# EAGLE design power_board (EAGLE 9.3.2)
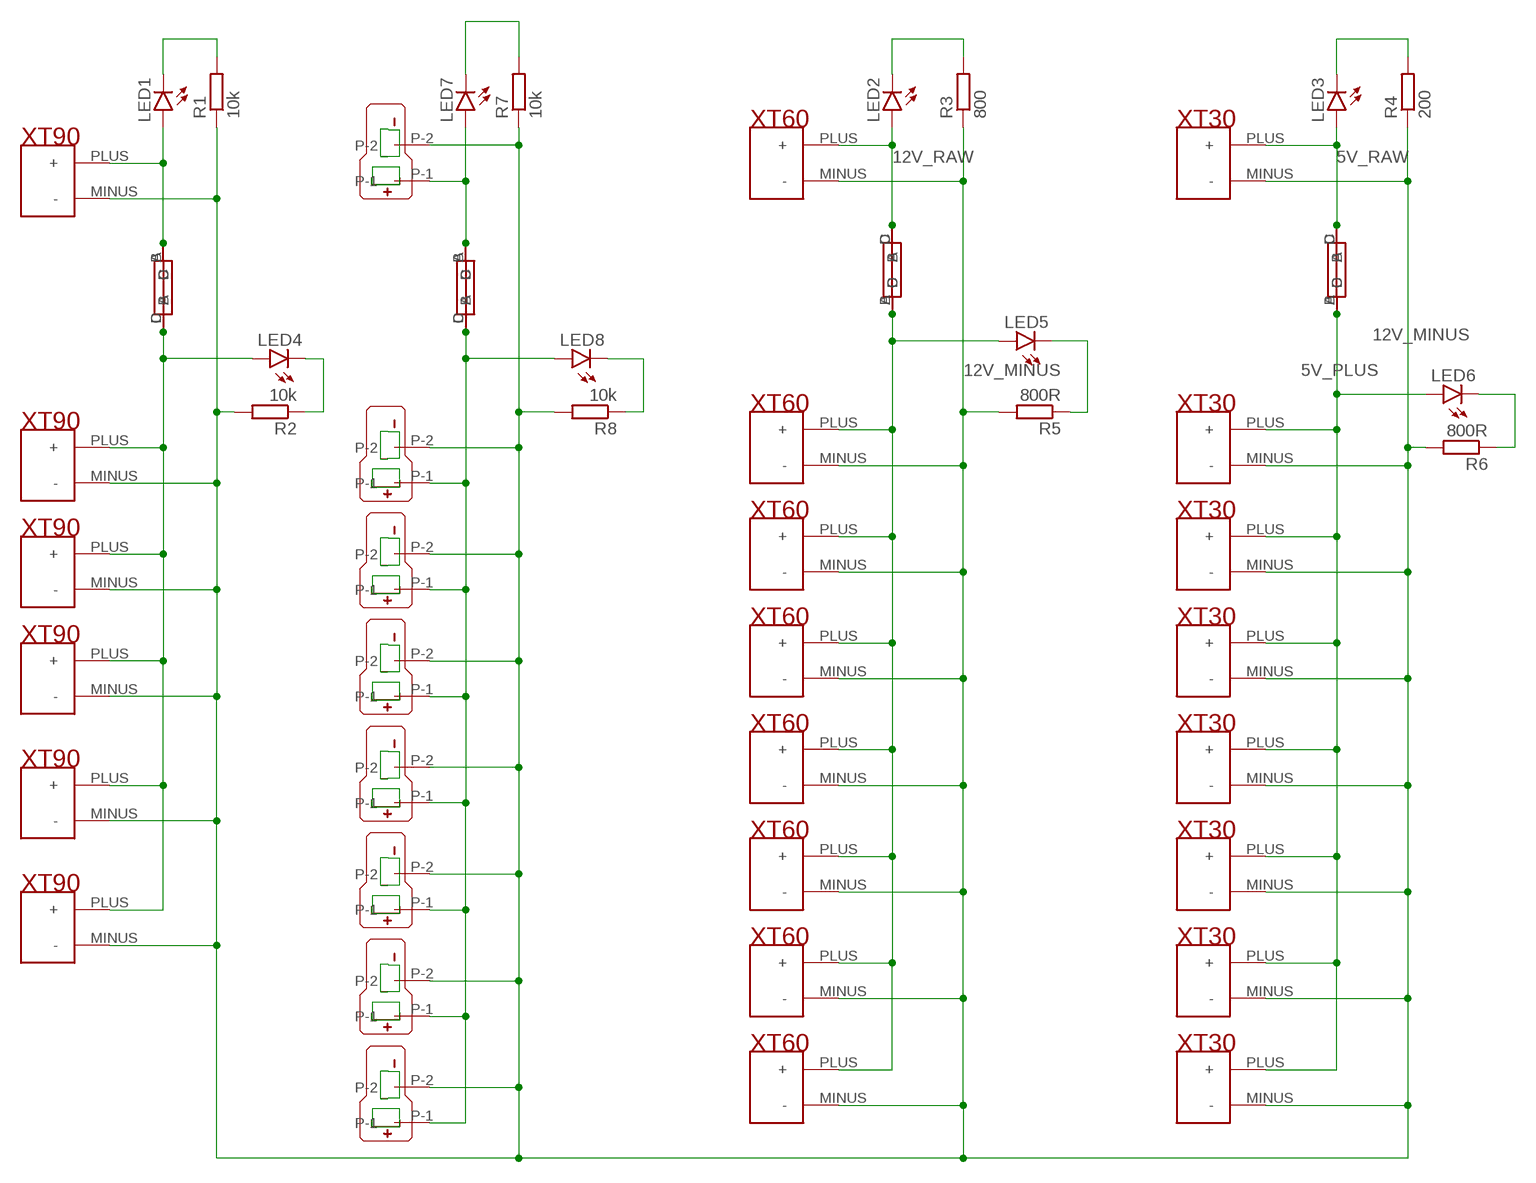
[diagram p0: schematic, sheet 1]

## Parts
LED1  LED5MM  [LED5MM]
LED2  LED5MM  [LED5MM]
LED3  LED5MM  [LED5MM]
LED4  LED5MM  [LED5MM]
LED5  LED5MM  [LED5MM]
LED6  LED5MM  [LED5MM]
LED7  LED5MM  [LED5MM]
LED8  LED5MM  [LED5MM]
R1  10k  R-EU_M1206  [M1206]
R2  10k  R-EU_M1206  [M1206]
R3  800  R-EU_M1206  [M1206]
R4  200  R-EU_M1206  [M1206]
R5  800R  R-EU_M1206  [M1206]
R6  800R  R-EU_M1206  [M1206]
R7  10k  R-EU_M1206  [M1206]
R8  10k  R-EU_M1206  [M1206]
U$1  XT90  [XT90_FOOTPRINT]
U$2  XT90  [XT90_FOOTPRINT]
U$3  XT90  [XT90_FOOTPRINT]
U$4  XT90  [XT90_FOOTPRINT]
U$5  XT60  [XT60_FOOTPRINT]
U$6  XT60  [XT60_FOOTPRINT]
U$7  XT60  [XT60_FOOTPRINT]
U$8  XT60  [XT60_FOOTPRINT]
U$9  XT60  [XT60_FOOTPRINT]
U$10  XT60  [XT60_FOOTPRINT]
U$11  XT60  [XT60_FOOTPRINT]
U$12  XT60  [XT60_FOOTPRINT]
U$13  XT30  [XT30_FOOTPRINT]
U$14  XT30  [XT30_FOOTPRINT]
U$15  XT30  [XT30_FOOTPRINT]
U$16  XT30  [XT30_FOOTPRINT]
U$17  XT30  [XT30_FOOTPRINT]
U$18  XT30  [XT30_FOOTPRINT]
U$19  XT30  [XT30_FOOTPRINT]
U$20  XT30  [XT30_FOOTPRINT]
U$21  AUTOFUSE  [AUTOFUSE_HOLDER]
U$22  AUTOFUSE  [AUTOFUSE_HOLDER]
U$23  AUTOFUSE  [AUTOFUSE_HOLDER]
U$24  XT90  [XT90_FOOTPRINT]
U$25  T-PLUG_CONNECTOR  [T_PLUG_CONNECTOR]
U$26  T-PLUG_CONNECTOR  [T_PLUG_CONNECTOR]
U$27  T-PLUG_CONNECTOR  [T_PLUG_CONNECTOR]
U$28  T-PLUG_CONNECTOR  [T_PLUG_CONNECTOR]
U$29  T-PLUG_CONNECTOR  [T_PLUG_CONNECTOR]
U$30  AUTOFUSE  [AUTOFUSE_HOLDER]
U$31  T-PLUG_CONNECTOR  [T_PLUG_CONNECTOR]
U$32  T-PLUG_CONNECTOR  [T_PLUG_CONNECTOR]
U$33  T-PLUG_CONNECTOR  [T_PLUG_CONNECTOR]
U$34  XT90  [XT90_FOOTPRINT]

## Nets
5V_PLUS: LED6.A U$14.PLUS(+) U$15.PLUS(+) U$16.PLUS(+) U$17.PLUS(+) U$18.PLUS(+) U$19.PLUS(+) U$20.PLUS(+) U$23.A U$23.B
5V_RAW: LED3.A U$13.PLUS(+) U$23.C U$23.D
12V_MINUS: R1.1 R2.2 R3.1 R4.1 R5.2 R6.2 R7.1 R8.2 U$1.MINUS(-) U$2.MINUS(-) U$3.MINUS(-) U$4.MINUS(-) U$5.MINUS(-) U$6.MINUS(-) U$7.MINUS(-) U$8.MINUS(-) U$9.MINUS(-) U$10.MINUS(-) U$11.MINUS(-) U$12.MINUS(-) U$13.MINUS(-) U$14.MINUS(-) U$15.MINUS(-) U$16.MINUS(-) U$17.MINUS(-) U$18.MINUS(-) U$19.MINUS(-) U$20.MINUS(-) U$24.MINUS(-) U$25.P-2 U$26.P-2 U$27.P-2 U$28.P-2 U$29.P-2 U$31.P-2 U$32.P-2 U$33.P-2 U$34.MINUS(-)
12V_PLUS: LED5.A U$6.PLUS(+) U$7.PLUS(+) U$8.PLUS(+) U$9.PLUS(+) U$10.PLUS(+) U$11.PLUS(+) U$12.PLUS(+) U$22.A U$22.B
12V_RAW: LED2.A U$5.PLUS(+) U$22.C U$22.D
BATT_PLUS: LED4.A U$2.PLUS(+) U$3.PLUS(+) U$4.PLUS(+) U$21.C U$21.D U$24.PLUS(+) U$34.PLUS(+)
BATT_RAW: LED1.A U$1.PLUS(+) U$21.A U$21.B
N$1: LED1.K(C) R1.2
N$2: LED5.K(C) R5.1
N$3: LED3.K(C) R4.2
N$4: LED6.K(C) R6.1
N$5: LED4.K(C) R2.1
N$8: LED2.K(C) R3.2
N$9: LED7.A U$25.P-1 U$30.A U$30.B
N$10: LED7.K(C) R7.2
N$12: LED8.A U$26.P-1 U$27.P-1 U$28.P-1 U$29.P-1 U$30.C U$30.D U$31.P-1 U$32.P-1 U$33.P-1
N$13: LED8.K(C) R8.1

## Library data of the parts
LED1-LED8 = led:LED: LED OSRAM: - CHIPLED LG R971, LG N971, LY N971, LG Q971, LY Q971, LO R971, LY R971 LH N974, LH R974 LS Q976, LO Q976, LY Q976 LO Q996 - Hyper CHIPLED LW Q18S LB Q993, LB Q99A, LB R99A - SideLED LS A670, LO A670, LY A670, LG A670, LP A670 LB A673, LV A673, LT A673, LW A673 LH A674 LY A675 LS A676, LA A676, LO A676, LY A676, LW A676 LS A679, LY A679, LG A679 - Hyper Micro SIDELED® LS Y876, LA Y876, LO Y876, LY Y876 LT Y87S - SmartLED LW L88C, LW L88S LB L89C, LB L89S, LG L890 LS L89K, LO L89K, LY L89K LS L896, LA L896, LO L896, LY L896 - TOPLED LS T670, LO T670, LY T670, LG T670, LP T670 LSG T670, LSP T670, LSY T670, LOP T670, LYG T670 LG T671, LOG T671, LSG T671 LB T673, LV T673, LT T673, LW T673 LH T674 LS T676, LA T676, LO T676, LY T676, LB T676, LH T676, LSB T676, LW T676 LB T67C, LV T67C, LT T67C, LS T67K, LO T67K, LY T67K, LW E67C LS E67B, LA E67B, LO E67B, LY E67B, LB E67C, LV E67C, LT E67C LW T67C LS T679, LY T679, LG T679 LS T770, LO T770, LY T770, LG T770, LP T770 LB T773, LV T773, LT T773, LW T773 LH T774 LS E675, LA E675, LY E675, LS T675 LS T776, LA T776, LO T776, LY T776, LB T776 LHGB T686 LT T68C, LB T68C - Hyper Mini TOPLED® LB M676 - Mini TOPLED Santana® LG M470 LS M47K, LO M47K, LY M47K Source: http://www.osram.convergy.de LUXEON: - LUMILED® LXK2-PW12-R00, LXK2-PW12-S00, LXK2-PW14-U00, LXK2-PW14-V00 LXK2-PM12-R00, LXK2-PM12-S00, LXK2-PM14-U00 LXK2-PE12-Q00, LXK2-PE12-R00, LXK2-PE12-S00, LXK2-PE14-T00, LXK2-PE14-U00 LXK2-PB12-K00, LXK2-PB12-L00, LXK2-PB12-M00, LXK2-PB14-N00, LXK2-PB14-P00, LXK2-PB14-Q00 LXK2-PR12-L00, LXK2-PR12-M00, LXK2-PR14-Q00, LXK2-PR14-R00 LXK2-PD12-Q00, LXK2-PD12-R00, LXK2-PD12-S00 LXK2-PH12-R00, LXK2-PH12-S00 LXK2-PL12-P00, LXK2-PL12-Q00, LXK2-PL12-R00 Source: www.luxeon.com KINGBRIGHT: KA-3528ASYC Source: www.kingbright.com
R1-R8 = rcl:R-EU_: RESISTOR, European symbol; SPICEPREFIX: R
U$1-U$4 U$24 U$34 = XT_connectors:XT90
U$5-U$12 = XT_connectors:XT60
U$13-U$20 = XT_connectors:XT30
U$21-U$23 U$30 = AutoFuse_Holder:AUTOFUSE
U$25-U$29 U$31-U$33 = con-T-plug:T-PLUG_CONNECTOR

## Board
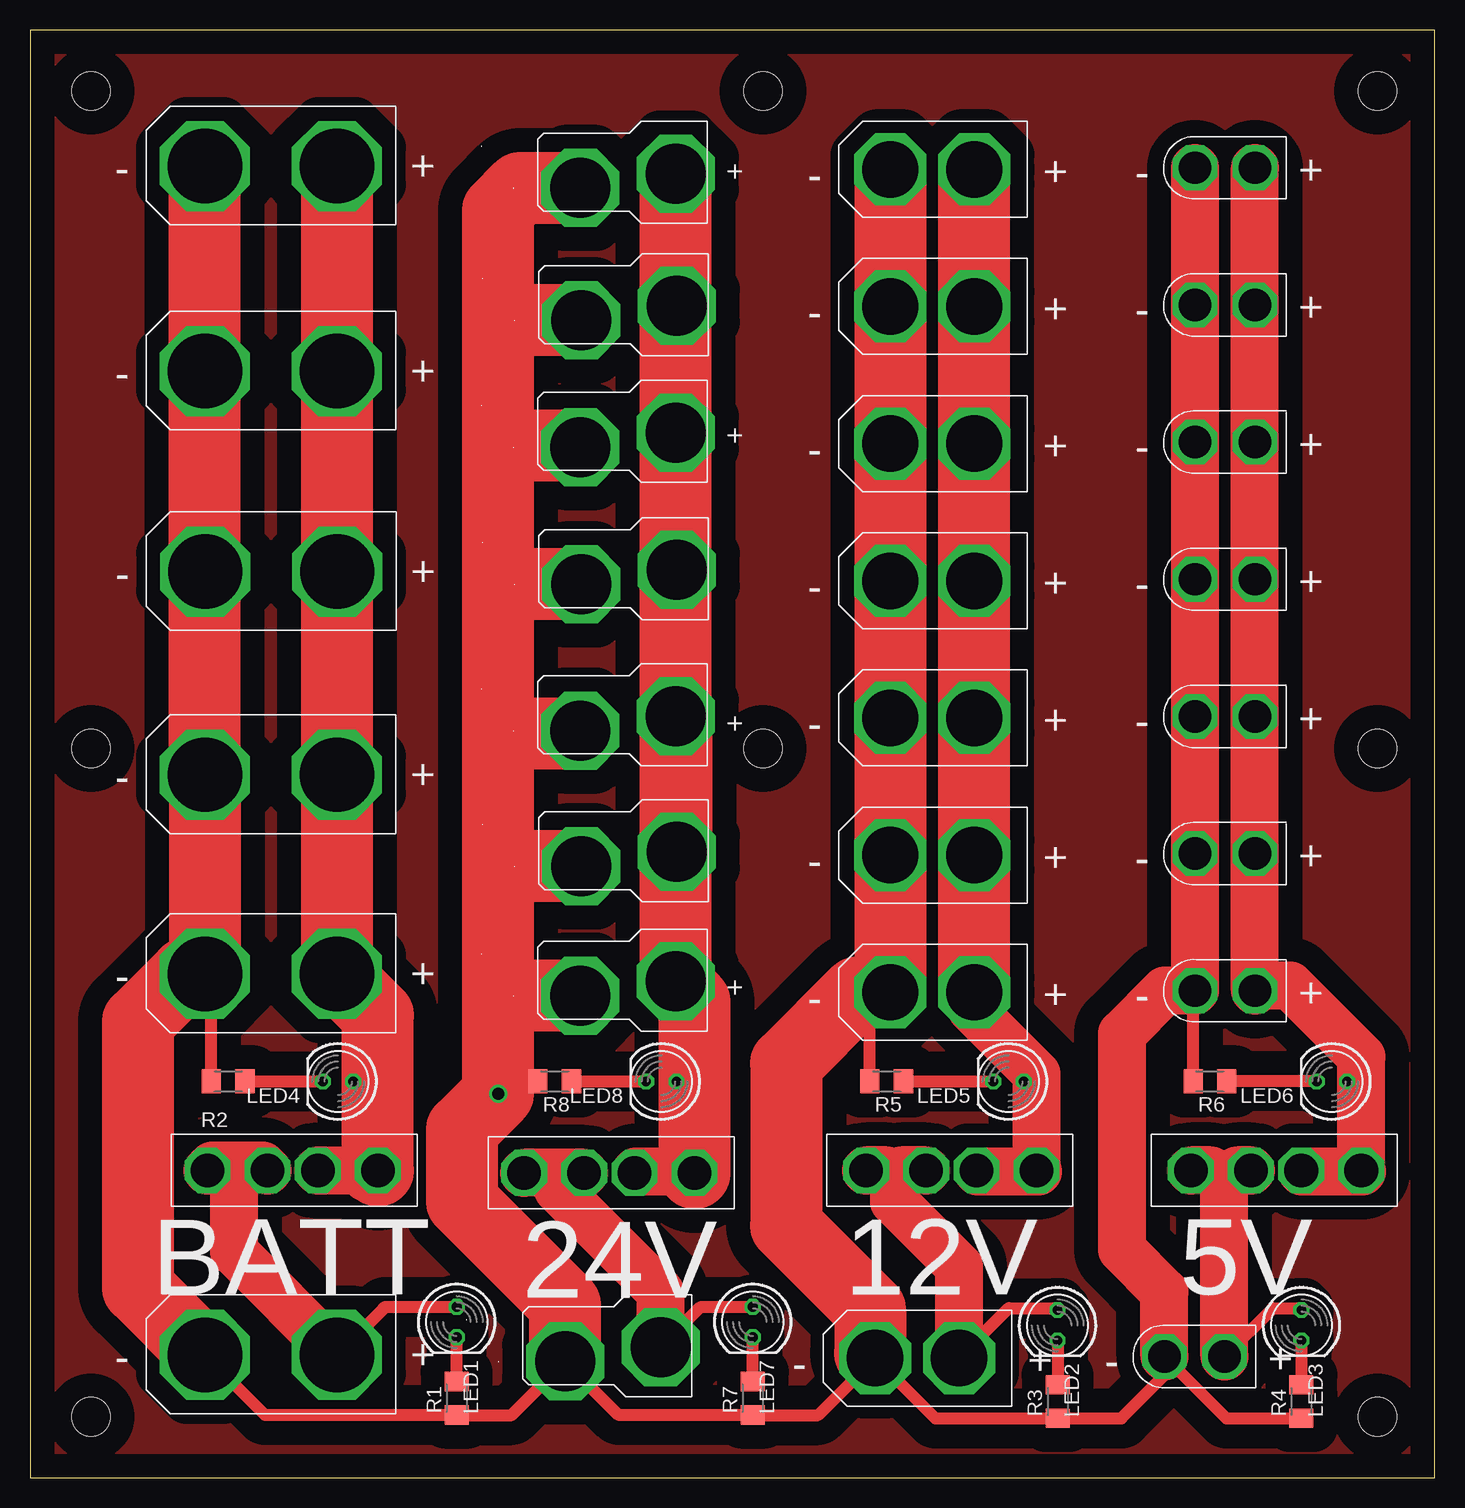
[diagram p1: board, top side]
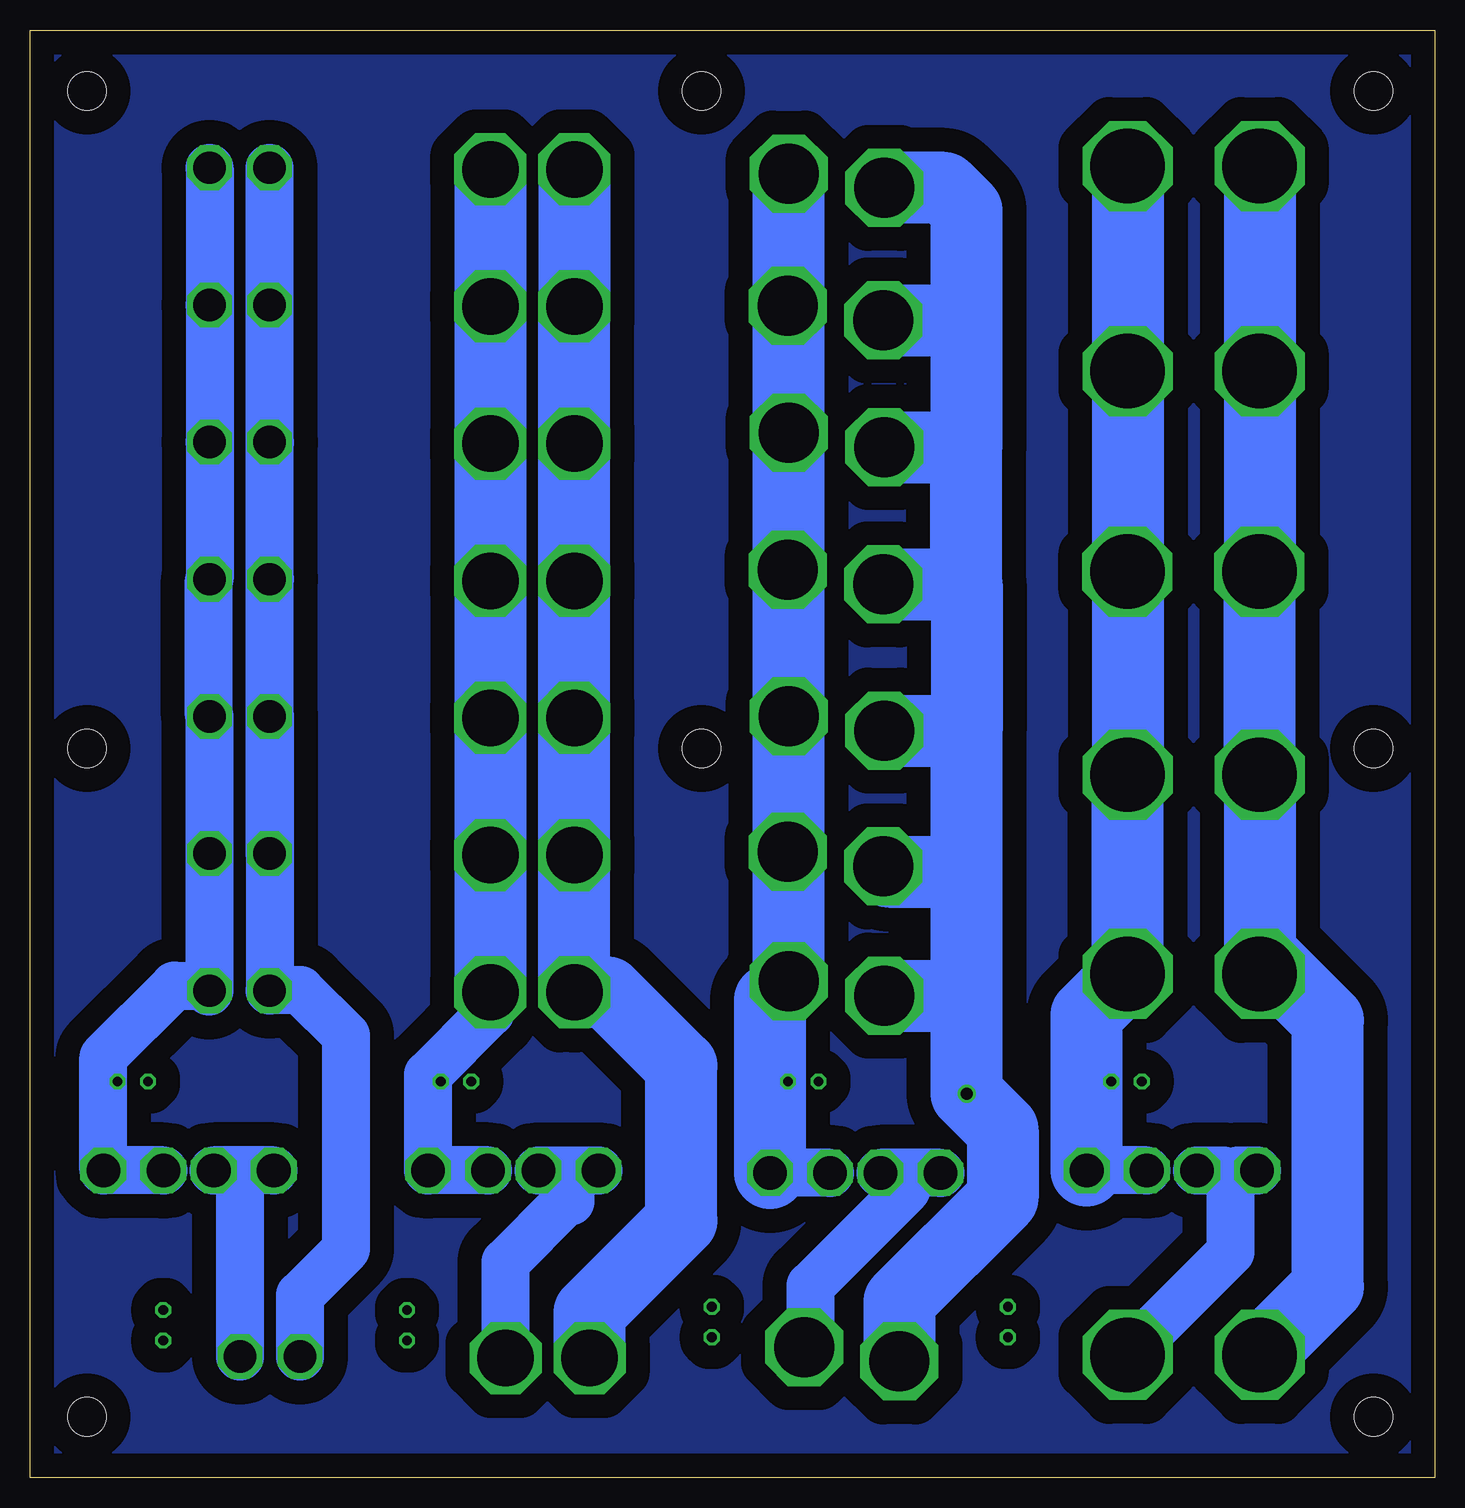
[diagram p2: board, bottom side, seen from below]

Size 117.05 x 120.64 mm. Coordinates in mm from the lower left corner, seen from the top.
Outline: 0,0 117.05,0 117.05,120.64 0,120.64 0,0
Copper layers (1*16): Top 0.035mm / dielectric 1.5mm / Bottom 0.035mm
Design rules "default": minimum track width 6mil, minimum drill 0.35mm, track to track 6mil, track to pad 6mil, pad to pad 6mil, via to via 6mil, smd to smd 6mil, copper to edge 40mil, drill to drill 6mil, minimum pad ring 10mil, minimum via ring 8mil, stop-mask expansion 4mil, vias tented up to drill 0mil, thermal gap 10mil
Holes 3.2 mm at 5.08,115.57 112.3,115.57 5.08,5.08 112.3,5.08 5.08,60.77 112.3,60.77 61.08,60.77 61.08,115.57

### Footprints (pad centres in the part's own frame; a part is rotated, then mirrored left to right if it is on the bottom)
LED5MM = drill 0.813 octagon: A -1.27,0; K 1.27,0
M1206 = smd 1.6 x 2: 1 -1.4,0; 2 1.4,0
XT90_FOOTPRINT = drill 6.2 pad 7.5 octagon: MINUS 15.9,5; PLUS 4.9,5
XT60_FOOTPRINT = drill 4.7 pad 6 octagon: MINUS 11.4,4; PLUS 4.4,4
XT30_FOOTPRINT = drill 2.7 octagon: MINUS 7.6,2.6; PLUS 2.6,2.6
AUTOFUSE_HOLDER = drill 2.8 pad 3.81 octagon: A 0,0; B 5,0; C 9.2,0; D 14.2,0
T_PLUG_CONNECTOR = drill 5 pad 6.5 octagon: P-1 2.6,4.35; P-2 10.55,5.55

### Placement (x,y rotation side)
LED1  35.56,12.97 270 top
LED2  85.63,12.7 270 top
LED3  105.95,12.7 270 top
LED4  25.67,33.02 180 top
LED5  81.55,33.02 180 top
LED6  108.49,33.02 180 top
LED7  60.23,12.97 270 top
LED8  52.61,33.02 180 top
R1  35.56,6.62 90 top
R2  16.51,33.02 180 top
R3  85.63,6.35 90 top
R4  105.95,6.35 90 top
R5  71.39,33.02 180 top
R6  98.33,33.02 180 top
R7  60.23,6.62 90 top
R8  43.72,33.02 180 top
U$1  30.48,15.24 180 top
U$2  30.48,114.3 180 top
U$3  30.48,46.99 180 top
U$4  30.48,97.21 180 top
U$5  81.82,13.97 180 top
U$6  83.09,101.6 180 top
U$7  83.09,78.74 180 top
U$8  83.09,90.17 180 top
U$9  83.09,55.88 180 top
U$10  83.09,67.31 180 top
U$11  83.09,113.03 180 top
U$12  83.09,44.45 180 top
U$13  102.14,12.7 180 top
U$14  104.68,54.61 180 top
U$15  104.68,88.9 180 top
U$16  104.68,100.33 180 top
U$17  104.68,77.47 180 top
U$18  104.68,66.04 180 top
U$19  104.68,111.76 180 top
U$20  104.68,43.18 180 top
U$21  14.79,25.6 0 top
U$22  83.88,25.6 180 top
U$23  110.94,25.6 180 top
U$24  30.48,63.58 180 top
U$25  55.15,15.24 180 top
U$26  56.42,91.44 180 top
U$27  56.42,45.72 180 top
U$28  56.42,67.81 180 top
U$29  56.42,113.03 180 top
U$30  41.18,25.4 0 top
U$31  56.5,102 180 top
U$32  56.5,80 180 top
U$33  56.5,56.5 180 top
U$34  30.5,80.5 180 top

### Tracks (layer width: path | path; a pad name or v marks a point on that pad's centre or on a via)
5V_PLUS
  Top 1: U$20.PLUS 102.14,40.64 103.41,40.64 109.76,34.29 LED6.A
  Top 4: U$20.PLUS U$19.PLUS | U$23.A 110.94,35.06 105,41 102.5,41 102.14,40.64
  Bottom 4: U$19.PLUS U$16.PLUS U$15.PLUS U$17.PLUS 102.14,74.81 102.14,63.5 U$18.PLUS U$14.PLUS U$20.PLUS 102.14,40.52 102.62,41 105,41 110.94,35.06 U$23.A U$23.B
5V_RAW
  Top 1: 103.56,14.12 105.8,14.12 LED3.A
  Top 1.016: U$13.PLUS 103.56,14.12
  Top 4: U$13.PLUS 99.54,24.46 98.4,25.6 U$23.D | U$23.C 100.6,25.6
  Bottom 4: U$23.D 99,25.6 | 99,25.6 U$23.C | U$13.PLUS 99.54,25.06 99,25.6
12V_MINUS  (via drill 1)
  Top 1: R5.2 69.99,38.75 U$12.MINUS | R6.2 96.93,40.43 U$20.MINUS | R2.2 15.11,41.46 U$3.MINUS | R8.2 40.02,33.02 v39,32 | R3.1 90.95,4.95 94.54,8.54 U$13.MINUS | U$5.MINUS 65.67,5.22 R7.1 49.07,5.22 U$25.P-2 40.13,5.22 R1.1
  Top 1.016: U$5.MINUS 75.44,4.95 R3.1 | U$13.MINUS 99.69,4.95 R4.1 | U$1.MINUS 19.6,5.22 R1.1
  Top 4: U$19.MINUS U$20.MINUS 94.58,40.58 91,37 91,19 94.54,15.46 U$13.MINUS
  Top 6: U$11.MINUS U$12.MINUS 68.95,40.45 63,34.5 63,21 70,14 70,10.39 U$5.MINUS | U$1.MINUS 9,15.82 9,38 13,42 U$3.MINUS U$24.MINUS 14.58,75.5 | 14.58,75.5 U$2.MINUS | U$25.P-2 44.6,14.4 36,23 36,29 v39,32 39,40 | U$29.P-2 40.87,107.48 39,105.61 39,96 | 39,40 39,51.5 | 39,51.5 39,62 | 39,62 39,74.5 | 39,74.5 39,86 | 39,86 39,96 | U$26.P-2 45.76,86 39,86 | U$28.P-2 45.61,62 39,62 | U$27.P-2 39.17,40.17 39,40 | U$31.P-2 39.45,96.45 39,96 | U$32.P-2 39.05,74.45 39,74.5 | U$33.P-2 39.55,50.95 39,51.5 | U$34.MINUS 14.58,75.5
  Bottom 4: U$18.MINUS 97.06,63.46 97.06,74.89 | U$19.MINUS U$16.MINUS U$15.MINUS 97.06,86.28 97.06,74.89 | U$13.MINUS 94.54,15.22 90.71,19.05 90.71,36.83 94.52,40.64 97.02,40.64 U$20.MINUS 97.06,40.6 97.06,53.26 97.08,53.28 U$18.MINUS | U$17.MINUS 97.06,74.89 | U$14.MINUS U$18.MINUS | 39.11,85.89 39,86 | 39.17,40.17 39,40
  Bottom 6: U$5.MINUS 70.42,13.78 62.77,21.43 62.77,34.29 68.93,40.45 U$12.MINUS U$9.MINUS U$10.MINUS U$7.MINUS U$8.MINUS U$6.MINUS U$11.MINUS | U$1.MINUS 8.89,15.93 8.89,38.1 12.78,41.99 | 12.78,41.99 U$3.MINUS | U$2.MINUS U$4.MINUS 14.58,75.52 U$34.MINUS 14.6,59.4 15,59 U$24.MINUS 14.58,43.79 12.78,41.99 | U$25.P-2 44.6,14.69 36,23.29 36,29 v39,32 39,40 39,50.5 | 39,50.5 39,62.26 | 39,96 39,86 39.05,85.95 39.05,74.45 | 39,96 39,105.61 40.87,107.48 U$29.P-2 | U$26.P-2 39.11,85.89 | U$28.P-2 39,62.26 | U$27.P-2 39.17,40.17 | U$33.P-2 45.5,50.5 39,50.5 | U$32.P-2 39.05,74.45 | 39.05,74.45 39,74.5 39,62.26 | U$31.P-2 39.45,96.45 39,96
12V_PLUS
  Top 1: LED5.A 82.82,36.32 U$12.PLUS
  Top 4: U$22.A 83.88,33.62 78.5,39
  Top 6: U$12.PLUS U$11.PLUS
  Bottom 4: U$12.PLUS 78.69,38.78 83.88,33.59 U$22.A U$22.B
  Bottom 6: U$11.PLUS U$6.PLUS U$8.PLUS U$7.PLUS U$10.PLUS U$9.PLUS U$12.PLUS
12V_RAW
  Top 1: 81.57,14.12 85.48,14.12 LED2.A
  Top 1.016: U$5.PLUS 81.57,14.12
  Top 4: U$5.PLUS 77.42,17.58 72,23 72,25 | 72,25 71.4,25.6 U$22.D | U$22.C 72.6,25.6 72,25
  Bottom 4: U$5.PLUS 77.42,17.97 72.39,23 72,23 72,25.6 | U$22.C 72,25.6 | 72,25.6 U$22.D
BATT_PLUS
  Top 1: LED4.A 26.94,40.57 25.55,41.96
  Top 4: U$21.C 27.4,25.6 28,25 28.39,25 U$21.D
  Top 6: U$2.PLUS 25.58,92 | 25.58,92 U$3.PLUS 25.55,41.96 28.99,38.52 U$21.D | U$34.PLUS 25.6,91.98 25.58,92
  Bottom 4: U$21.C U$21.D
  Bottom 6: U$21.D 29,38.57 U$3.PLUS U$24.PLUS U$4.PLUS U$2.PLUS
BATT_RAW
  Top 1: 29.46,14.12 29.58,14.24 LED1.A
  Top 1.016: U$1.PLUS 29.46,14.12
  Top 4: U$1.PLUS 17,18.82 17,26 | 17,26 15.19,26 U$21.A | U$21.B 19.39,26 17,26
  Bottom 4: U$1.PLUS 17,18.82 17,25 | 17,25 16.4,25.6 U$21.A | U$21.B 17.6,25.6 17,25
N$1
  Top 1: R1.2 LED1.K
N$2
  Top 1: R5.1 LED5.K
N$3
  Top 1: LED3.K R4.2
N$4
  Top 1: LED6.K R6.1
N$5
  Top 1: R2.1 LED4.K
N$6
  pour Top (isolate 2): 0,0 0,121 117,121 117,0
N$7
  pour Bottom (isolate 2): 0,0 117,0 117,121 0,121
N$8
  Top 1: LED2.K R3.2
N$9
  Top 1: U$25.P-1 55.9,14.24 LED7.A
  Top 4: U$25.P-1 52.55,15.45 44,24 44,25 43.6,25.4 | 43.6,25.4 U$30.A | U$30.B 43.6,25.4
  Bottom 4: U$30.A 44,25.4 | 44,25.4 U$30.B | U$25.P-1 52,10.89 52,16 44,24 44,25.4
N$10
  Top 1: R7.2 LED7.K
N$11
  Top 4: 55.5,25.5 50.5,25.5
N$12
  Top 1: LED8.A 55.38,31.52 U$30.D
  Top 6: U$30.D 55.38,39.62 53.82,41.18 U$28.P-1 | U$28.P-1 53.82,75.5 | 53.82,75.5 U$26.P-1 53.82,97.5 | U$33.P-1 53.9,63.38 U$28.P-1 | U$32.P-1 53.9,75.58 53.82,75.5 | 53.82,97.5 U$29.P-1 | U$31.P-1 53.9,97.58 53.82,97.5
  Bottom 4: 55.38,39.81 U$27.P-1 | U$30.C U$30.D
  Bottom 6: U$30.D 55.38,39.81 | U$27.P-1 U$28.P-1 U$26.P-1 U$29.P-1
N$13
  Top 1: R8.1 LED8.K
N$14
  Top 4: 111,25.5 106,25.5
N$15
  Top 4: 84,25.5 79,25.5

### Text on the board
tPlace: + | + | + | + | BATT | 24V | 12V | 5V